# Altium schematic sheet Badge_Cig.SchDoc: UHF Audio Transmitter
size A4; DrawnBy: Engr. Talha Waheed; SheetNumber: 1
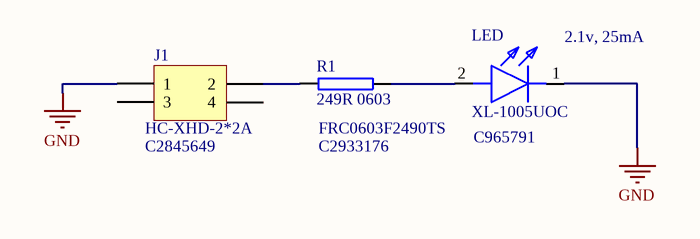
[diagram p0: Badge_Cig.SchDoc]

## Parts
J1  HC-XHD-2*2A  [HDR2X2_AUT]
LED  XL-1005UOC  [150040GS73240]
R1  249R 0603  [Res_0603]

## Nets
GND: J1.1 LED.1(K)
NetJ1_2: J1.2 R1.1
NetLED_2: LED.2(A) R1.2

Not connected (* = marked no-connect by the designer): J1 3 4

## Notes on the sheet
- (near LED) 2.1v, 25mA
- (near J1) C2845649
- FRC0603F2490TS
- (near R1) C2933176
- (near LED) C965791

## Library data of the parts
J1 = HDR2X2: Header, 2-Pin, Dual row, 2.54mm Pitch, Straight; Supplier 1: Farnell; Supplier Part Number 1: 2356130
LED = 150040GS73240: LED; Manufacturer_Name: Wurth Elektronik; Datasheet Link: https://componentsearchengine.com/Datasheets/2/150040GS73240.pdf; Height: 0.5mm; Manufacturer_Part_Number: 150040GS73240; Mouser Part Number: 710-150040GS73240; Mouser Price/Stock: https://www.mouser.co.uk/ProductDetail/Wurth-Elektronik/150040GS73240?qs=fAHHVMwC%252Bbgmx0FZHKuCJg%3D%3D
R1 = Resistor 1206: Resistor, SMD, 1206